# Altium schematic sheet Supply.SchDoc
size A3; DocumentNumber: 3; SheetNumber: 3; SheetTotal: 10; PageSetup: Record=PageOptions|CenterHorizontal=True|CenterVertical=True|PrintScale=0.97|XCorrection=1.00|YCorrection=1.00|PrintKind=1|BorderSize=5000000|LeftOffset=0|BottomOffset=0|Orientation=2|PaperLength=2970|PaperWidth=2100|Scale=100|PaperSource=7|PrintQuality=600|MediaType=1|DitherType=10|PaperKind=A4|PrintScaleMode=1
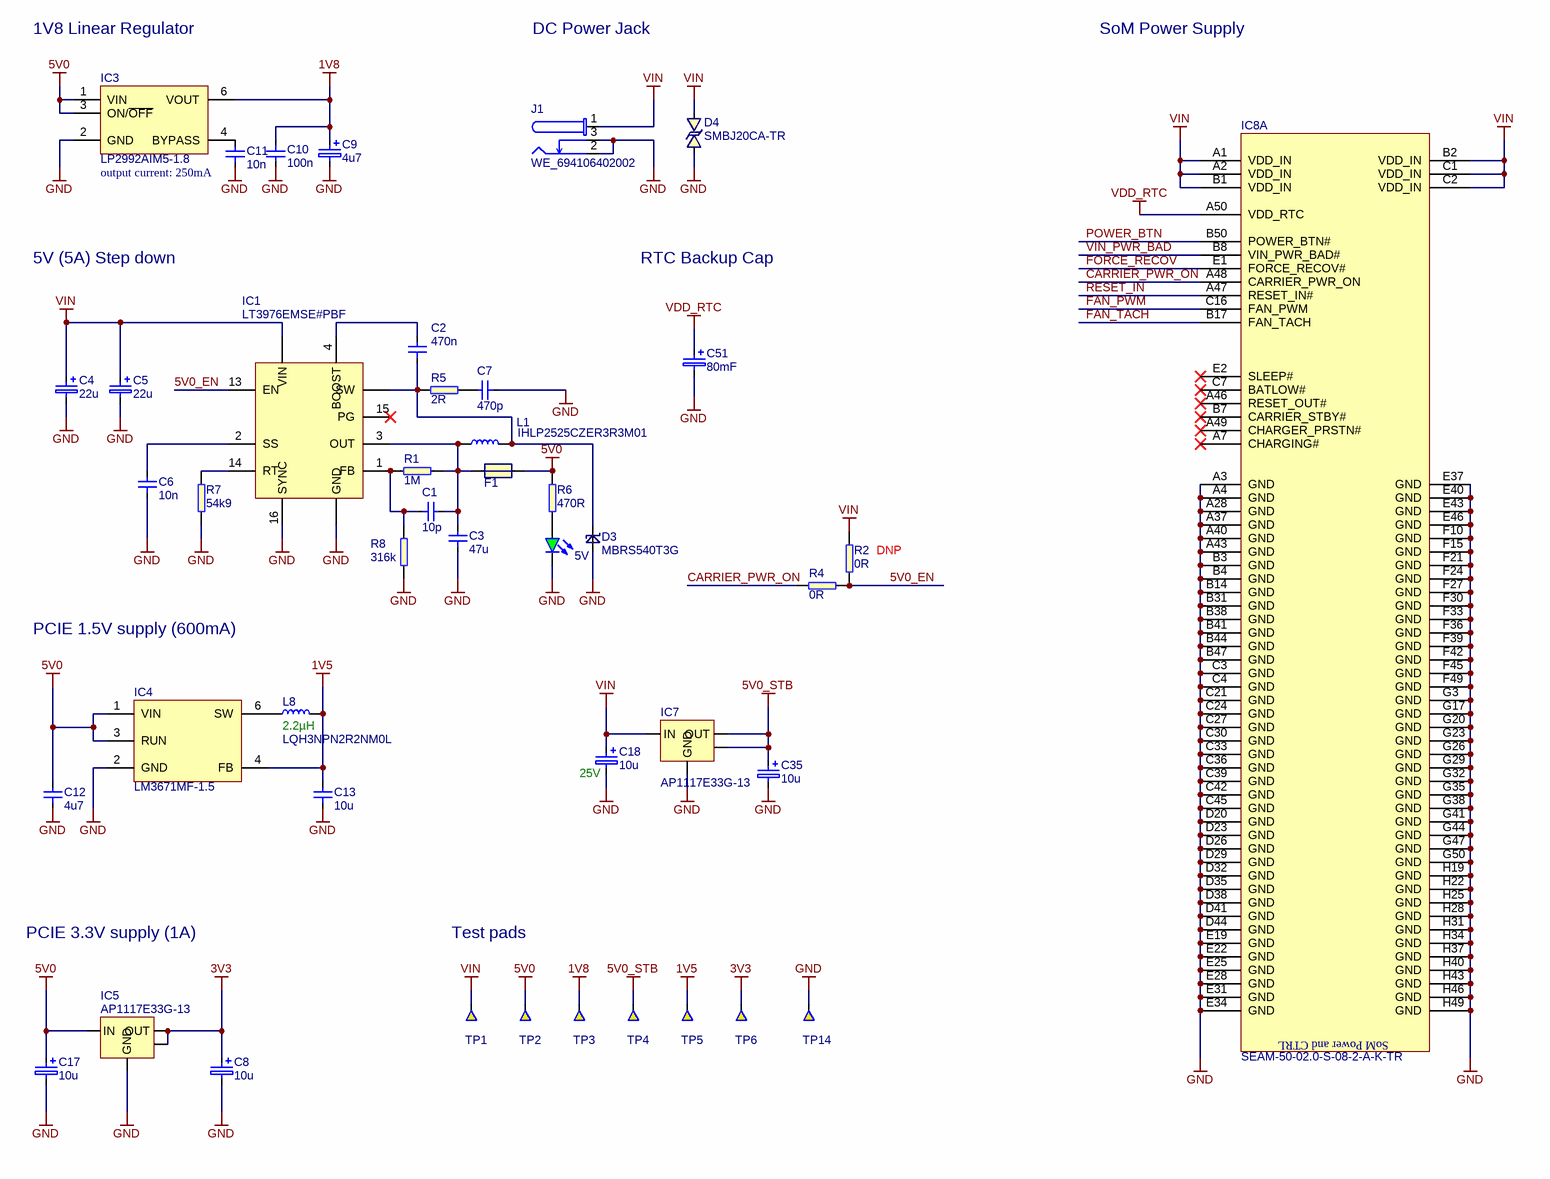
[diagram p0: Supply.SchDoc]

## Parts
5V  KPT-1608SGC  [LED0603]  (value not drawn)
C1  10p  [0603]
C2  470n  [0603]
C3  47u  [1206]
C4  22u  [KEMET_C]
C5  22u  [KEMET_C]
C6  10n  [0603]
C7  470p  [0603]
C8  10u  [KEMET_A]
C9  4u7  [KEMET_A]
C10  100n  [0603]
C11  10n  [0603]
C12  4u7  [0603]
C13  10u  [0603]
C17  10u  [KEMET_A]
C18  10u  [KEMET_C]
C35  10u  [KEMET_A]
C51  80mF  [XH414HG-IV01E]
D3  MBRS540T3G  [SMC-403-03]
D4  SMBJ20CA-TR  [DO-214AA]
F1  3.0A  [Fuse-MF-LSMF]  (value not drawn)
IC1  LT3976EMSE#PBF  [LT3976EMSE]
IC3  LP2992AIM5-1.8  [SOT23-5N]
IC4  LM3671MF-1.5  [SOT23-5N]
IC5  AP1117E33G-13  [SOT223]
IC7  AP1117E33G-13  [SOT223]
IC8  SEAM-50-02.0-S-08-2-A-K-TR  [Nvidia-TX1-SoM]  (part A of 4)
J1  WE_694106402002  [WE_694106402002]
L1  IHLP2525CZER3R3M01  [IHLP-2525CZ-01]
L8  LQH3NPN2R2NM0L  [LQH3NPN2R2NM]
R1  1M  [0603]
R2  0R  [0603]
R4  0R  [0603]
R5  2R  [0603]
R6  470R  [0603]
R7  54k9  [0603]
R8  316k  [0603]
TP1  (no value)  [TP-R-2]  (no BOM)
TP2  (no value)  [TP-R-2]  (no BOM)
TP3  (no value)  [TP-R-2]  (no BOM)
TP4  (no value)  [TP-R-2]  (no BOM)
TP5  (no value)  [TP-R-2]  (no BOM)
TP6  (no value)  [TP-R-2]  (no BOM)
TP14  (no value)  [TP-R-2]  (no BOM)

## Nets
1V5: C13.2 IC4.4(FB) L8.2 TP5.1
1V8: C9.1 C10.1 IC3.6(VOUT) TP3.1
3V3: C8.1 IC5.2(OUT) IC5.4(OUT) TP6.1
5V0: C12.2 C17.1 F1.2 IC3.1(VIN) IC3.3(ON/~{OFF}) IC4.1(VIN) IC4.3(RUN) IC5.3(IN) R6.2 TP2.1
5V0_STB: C35.1 IC7.2(OUT) IC7.4(OUT) TP4.1
GND: 5V.K C3.1 C4.2 C5.2 C6.1 C7.1 C8.2 C9.2 C10.2 C11.1 C12.1 C13.1 C17.2 C18.2 C35.2 C51.2 D3.A D4.A IC1.16(SYNC) IC1.GND IC3.2(GND) IC4.2(GND) IC5.1(GND) IC7.1(GND) IC8.A3(GND) IC8.A4(GND) IC8.A28(GND) IC8.A37(GND) IC8.A40(GND) IC8.A43(GND) IC8.B3(GND) IC8.B4(GND) IC8.B14(GND) IC8.B31(GND) IC8.B38(GND) IC8.B41(GND) IC8.B44(GND) IC8.B47(GND) IC8.C3(GND) IC8.C4(GND) IC8.C21(GND) IC8.C24(GND) IC8.C27(GND) IC8.C30(GND) IC8.C33(GND) IC8.C36(GND) IC8.C39(GND) IC8.C42(GND) IC8.C45(GND) IC8.D20(GND) IC8.D23(GND) IC8.D26(GND) IC8.D29(GND) IC8.D32(GND) IC8.D35(GND) IC8.D38(GND) IC8.D41(GND) IC8.D44(GND) IC8.E19(GND) IC8.E22(GND) IC8.E25(GND) IC8.E28(GND) IC8.E31(GND) IC8.E34(GND) IC8.E37(GND) IC8.E40(GND) IC8.E43(GND) IC8.E46(GND) IC8.F10(GND) IC8.F15(GND) IC8.F21(GND) IC8.F24(GND) IC8.F27(GND) IC8.F30(GND) IC8.F33(GND) IC8.F36(GND) IC8.F39(GND) IC8.F42(GND) IC8.F45(GND) IC8.F49(GND) IC8.G3(GND) IC8.G17(GND) IC8.G20(GND) IC8.G23(GND) IC8.G26(GND) IC8.G29(GND) IC8.G32(GND) IC8.G35(GND) IC8.G38(GND) IC8.G41(GND) IC8.G44(GND) IC8.G47(GND) IC8.G50(GND) IC8.H19(GND) IC8.H22(GND) IC8.H25(GND) IC8.H28(GND) IC8.H31(GND) IC8.H34(GND) IC8.H37(GND) IC8.H40(GND) IC8.H43(GND) IC8.H46(GND) IC8.H49(GND) J1.2 J1.3 R7.1 R8.1 TP14.1
VDD_RTC: C51.1 IC8.A50(VDD_RTC)
VIN: C4.1 C5.1 C18.1 D4.C IC1.VIN IC7.3(IN) IC8.A1(VDD_IN) IC8.A2(VDD_IN) IC8.B1(VDD_IN) IC8.B2(VDD_IN) IC8.C1(VDD_IN) IC8.C2(VDD_IN) J1.1 R2.2 TP1.1
5V0_EN: IC1.13(EN) R2.1 R4.1
CARRIER_PWR_ON: IC8.A48(CARRIER_PWR_ON) R4.2
FAN_PWM: IC8.C16(FAN_PWM)
FAN_TACH: IC8.B17(FAN_TACH)
FORCE_RECOV: IC8.E1(FORCE_RECOV#)
POWER_BTN: IC8.B50(POWER_BTN#)
RESET_IN: IC8.A47(RESET_IN#)
VIN_PWR_BAD: IC8.B8(VIN_PWR_BAD#)
Net5V_A: 5V.A R6.1
NetC1_1: C1.1 IC1.1(FB) R1.2 R8.2
NetC1_2: C1.2 C3.2 F1.1 IC1.3(OUT) L1.2 R1.1
NetC2_1: C2.1 D3.C IC1.SW L1.1 R5.2
NetC2_2: C2.2 IC1.4(BOOST)
NetC6_2: C6.2 IC1.2(SS)
NetC7_2: C7.2 R5.1
NetC11_2: C11.2 IC3.4(BYPASS)
NetIC1_14: IC1.14(RT) R7.2
NetIC4_6: IC4.6(SW) L8.1

Not connected (* = marked no-connect by the designer): IC1 15(PG)*; IC8 A7(CHARGING#)* A46(RESET_OUT#)* A49(CHARGER_PRSTN#)* B7(CARRIER_STBY#)* C7(BATLOW#)* E2(SLEEP#)*

## Notes on the sheet
- 1V8 Linear Regulator
- DC Power Jack
- SoM Power Supply
- (near C11) output current: 250mA
- 5V (5A) Step down
- RTC Backup Cap
- (near R2) DNP
- PCIE 1.5V supply (600mA)
- (near L8) 2.2µH
- (near C18) 25V
- PCIE 3.3V supply (1A)
- Test pads
- Title:
- Size:
- Date:
- A3
- Revision:
- Page:
- of
- Antmicro Ltd.
- File:
- www.antmicro.com
- (in symbol Nvidia-TX1-SoM, part A) SoM Power and CTRL

## Library data of the parts
5V = LED_G: LED Green 0603 case; Manufacturer: KINGBRIGHT; Part Number: LED_G; Value: KPT-1608SGC; Part Symbol: KPT-1608SGC
C1 = C_10p_0603: MLCC SMT Capacitor 10pF 0603; Manufacturer: JOHANSON TECHNOLOGY; Part Symbol: 251R14S100GV4T; Value: 10p; Part Number: C_10p_0603
C2 = C_470n_0603: MLCC SMT Capacitor 470nF 0603; Manufacturer: TDK; Part Symbol: C1608X5R1H474K080AB; Value: 470n; Part Number: C_470n_0603
C3 = C_47u_1206: MLCC SMT Capacitor 47uF 1206; Manufacturer: MURATA; Part Symbol: GRM31CC80J476KE18L; Value: 47u; Part Number: C_47u_1206
C4 C5 = C_22u_KEMET_C: Tantalum SMT Capacitor 22uF Case KEMET_C; Manufacturer: KEMET; Part Symbol: T491C226K025AT; Part Number: C_22u_KEMET_C; Value: 22u
C6 C11 = C_10n_0603: MLCC SMT Capacitor 10nF 0603; Manufacturer: AVX; Part Symbol: 06031C103JAT2A; Value: 10n; Part Number: C_10n_0603
C7 = C_470p_0603: MLCC SMT Capacitor 470pF 0603; Manufacturer: AVX; Part Symbol: 06031C471JAT2A; Value: 470p; Part Number: C_470p_0603
C8 C17 C35 = C_10u_KEMET_A: Tantalum SMT Capacitor 10uF Case KEMET_A; Manufacturer: VISHAY; Part Symbol: 293D106X9016A2TE3; Value: 10u; Part Number: C_10u_KEMET_A
C9 = C_4u7_KEMET_A: Tantalum SMT Capacitor 4u7F Case KEMET_A; Manufacturer: KEMET; Part Symbol: T491A475K010AT; Value: 4u7; Part Number: C_4u7_KEMET_A
C10 = C_100n_0603: MLCC SMT Capacitor 100nF 0603; Manufacturer: WALSIN; Part Symbol: 0603B104K500CT; Value: 100n; Part Number: C_100n_0603
C12 = C_4u7_0603: MLCC SMT Capacitor 4u7F 0603; Manufacturer: MULTICOMP; Part Symbol: MC0603X475K6R3CT; Value: 4u7; Part Number: C_4u7_0603
C13 = C_10u_0603: MLCC SMT Capacitor 10uF 0603; Manufacturer: MULTICOMP; Part Symbol: MC0603X106M6R3CT; Value: 10u; Part Number: C_10u_0603
C18 = C_10u_KEMET_C: Tantalum SMT Capacitor 10uF Case KEMET_C; Manufacturer: KEMET; Part Symbol: T491C106K025AT; Part Number: C_10u_KEMET_C; Value: 10u
C51 = XH414HG-IV01E: CAP 80MF 3.3V SURFACE MOUNT; Manufacturer: SEIKO; Part Number: XH414HG-IV01E; Value: 80mF; Part Symbol: XH414HG-IV01E
D3 = MBRS540T3G: ON SEMICONDUCTOR  MBRS540T3G  Rectifier Diode, Single, 40 V, 5 A, 500 mV, 190 A; Part Number: MBRS540T3G; Value: MBRS540T3G; Manufacturer: ON SEMICONDUCTOR; Part Symbol: MBRS540T3G
D4 = SMBJ20CA: DIODE, TVS, 20V, 600W; Manufacturer: STMICROELECTRONICS; Part Number: SMBJ20CA; Value: SMBJ20CA-TR; Part Symbol: SMBJ20CA-TR
F1 = MF-LSMF300X-2: 3.0A, 6V, PTC Resettabe Fuse; Manufacturer: BOURNS; Part Number: MF-LSMF300X-2; Value: 3.0A; Part Symbol: MF-LSMF300X-2
IC1 = LT3976: LINEAR TECHNOLOGY  LT3976EMSE#PBF  DC-DC CONVERTER, 2MHZ, 5A, MSOP-16; Part Number: LT3976EMSE#PBF; Value: LT3976EMSE#PBF; Manufacturer: LINEAR TECHNOLOGY; Part Symbol: LT3976EMSE#PBF
IC3 = LP2992AIM5-1.8: LDO 1.8V 250mA; Manufacturer: TEXAS INSTRUMENTS; Part Symbol: LP2992AIM5-1.8/NOPB; Part Number: LP2992AIM5-1.8; Value: LP2992AIM5-1.8
IC4 = LM3671: DC/DC Buck Converter; Manufacturer: TEXAS INSTRUMENTS; Part Symbol: LM3671MF-1.5/NOPB; Part Number: LM3671MF-1.5; Value: LM3671MF-1.5
IC5 IC7 = AP1117E33G-13: IC, LDO, REG, 3.3V, SOT223; Manufacturer: DIODES INC.; Value: AP1117E33G-13; Part Number: AP1117E33G-13; Part Symbol: AP1117E33G-13
IC8 = Nvidia-TX1-SoM: TX1 module (board connector); Manufacturer: Samtec; Part Number: Nvidia-TX1-SoM; Part Symbol: SEAM-50-02.0-S-08-2-A-K-TR; Value: SEAM-50-02.0-S-08-2-A-K-TR
J1 = WE_694106402002: WURTH ELEKTRONIK 	694106402002  POWER ENTRY, JACK, 2MM, VERTICAL THT, 3A; Part Number: WE_694106402002; Value: WE_694106402002; Manufacturer: WURTH ELEKTRONIK; Part Symbol: 694106402002
L1 = IHLP2525CZER3R3M01: 3.3 uH, +/- 20%, Shielded, 0.02 ohm, 8 A; Manufacturer: VISHAY; Part Number: IHLP2525CZER3R3M01; Value: IHLP2525CZER3R3M01; Part Symbol: IHLP2525CZER3R3M01
L8 = LQH3NPN2R2NM0L: INDUCTOR, 2.2 uH, +/- 30%, 1212, 90 MHz, 0.073 ohm; Manufacturer: MURATA; Part Number: LQH3NPN2R2NM0L; Value: LQH3NPN2R2NM0L; Part Symbol: LQH3NPN2R2NM0L
R1 = R_1M_0603: SMT Resistor 1M 0603; Manufacturer: BOURNS; Part Symbol: CR0603-JW-105GLF; Value: 1M; Part Number: R_1M_0603
R2 R4 = R_0R_0603: SMT Resistor 0R 0603; Manufacturer: BOURNS; Part Symbol: CR0603-J/-000ELF; Part Number: R_0R_0603; Value: 0R
R5 = R_2R_0603: SMT Resistor 2R 0603; Manufacturer: MULTICOMP; Part Symbol: MCSR06W2R00FTL; Value: 2R; Part Number: R_2R_0603
R6 = R_470R_0603: SMT Resistor 470R 0603; Manufacturer: BOURNS; Part Symbol: CR0603-JW-471GLF; Value: 470R; Part Number: R_470R_0603
R7 = R_54k9_0603: SMT Resistor 54k9 0603; Manufacturer: PANASONIC ELECTRONIC COMPONENTS; Part Symbol: ERJ3EKF5492V; Value: 54k9; Part Number: R_54k9_0603
R8 = R_316k_0603: SMT Resistor 316k 0603; Manufacturer: MULTICOMP; Part Symbol: MC0063W06031316K; Value: 316k; Part Number: R_316k_0603
TP1-TP6 TP14 = TP-R-2: Testpad, round, 2mm; Part Number: TP-R-2